# EAGLE design hdmi_receiver_backup (EAGLE 5.05)

## Sheet 1 of 2
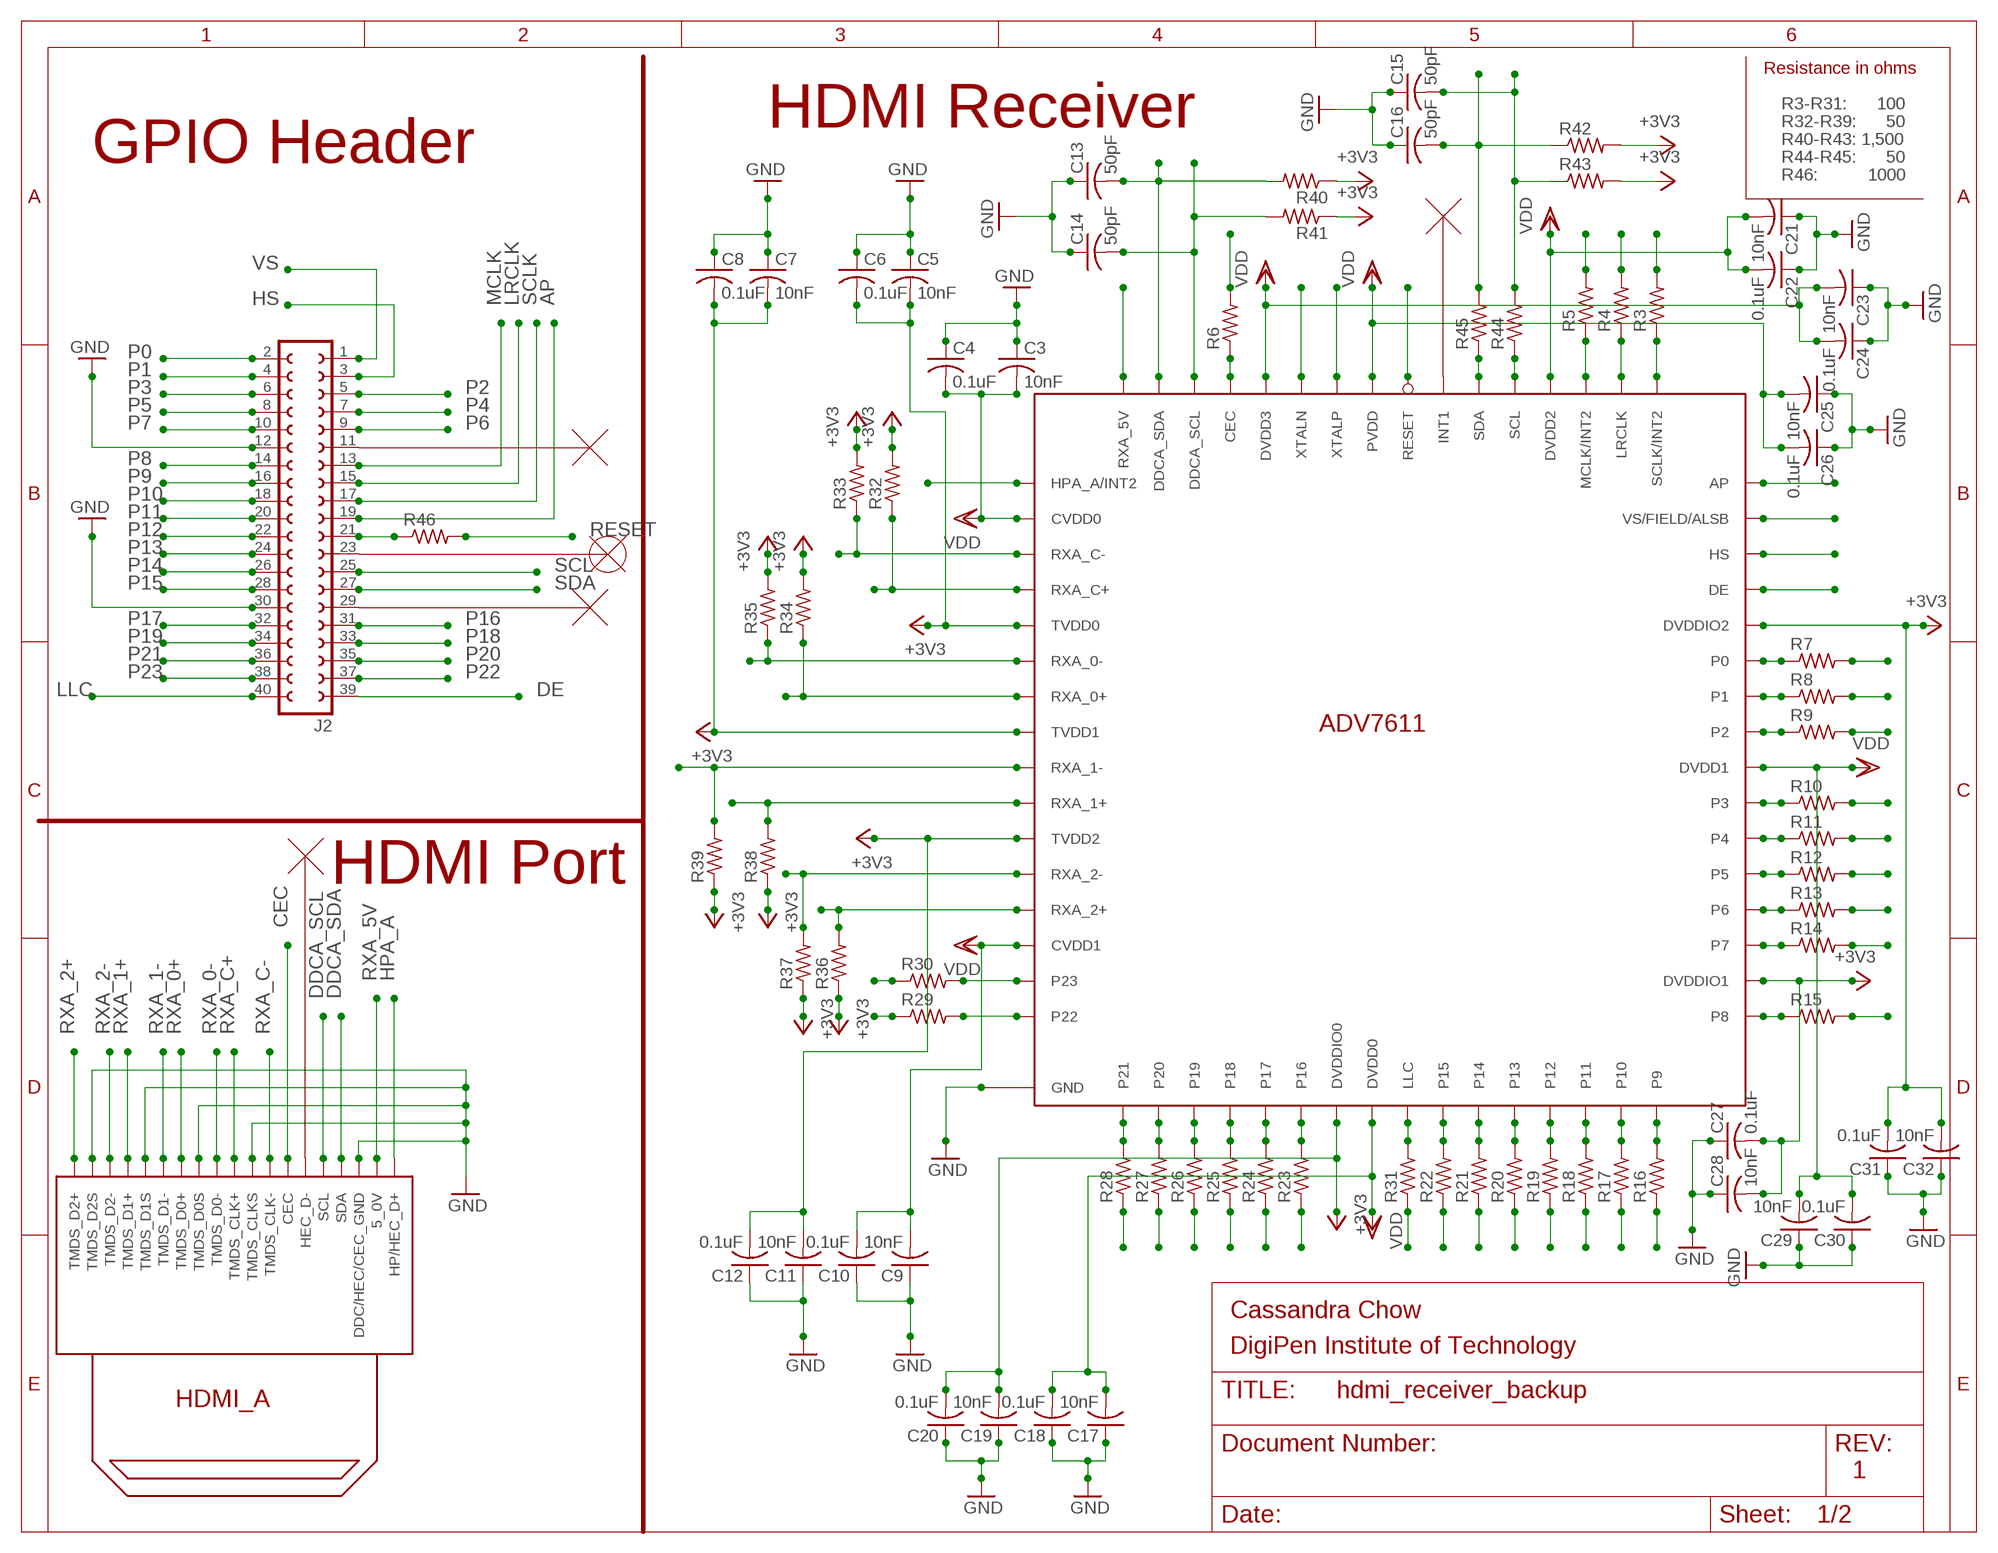
[diagram p0: schematic, sheet 1]

### Parts
ADV7611  ADV7611  [LQFP-ST-64-2]
C3  10nF  C-USC0603  [C0603]
C4  0.1uF  C-USC0603  [C0603]
C5  10nF  C-USC0603  [C0603]
C6  0.1uF  C-USC0603  [C0603]
C7  10nF  C-USC0603  [C0603]
C8  0.1uF  C-USC0603  [C0603]
C9  10nF  C-USC0603  [C0603]
C10  0.1uF  C-USC0603  [C0603]
C11  10nF  C-USC0603  [C0603]
C12  0.1uF  C-USC0603  [C0603]
C13  50pF  C-USC0603  [C0603]
C14  50pF  C-USC0603  [C0603]
C15  50pF  C-USC0603  [C0603]
C16  50pF  C-USC0603  [C0603]
C17  10nF  C-USC0603  [C0603]
C18  0.1uF  C-USC0603  [C0603]
C19  10nF  C-USC0603  [C0603]
C20  0.1uF  C-USC0603  [C0603]
C21  10nF  C-USC0603  [C0603]
C22  0.1uF  C-USC0603  [C0603]
C23  10nF  C-USC0603  [C0603]
C24  0.1uF  C-USC0603  [C0603]
C25  10nF  C-USC0603  [C0603]
C26  0.1uF  C-USC0603  [C0603]
C27  0.1uF  C-USC0603  [C0603]
C28  10nF  C-USC0603  [C0603]
C29  10nF  C-USC0603  [C0603]
C30  0.1uF  C-USC0603  [C0603]
C31  0.1uF  C-USC0603  [C0603]
C32  10nF  C-USC0603  [C0603]
J2  FE20-2  [FE20-2]
R3  R-US_R0603  [R0603]
R4  R-US_R0603  [R0603]
R5  R-US_R0603  [R0603]
R6  R-US_R0603  [R0603]
R7  R-US_R0603  [R0603]
R8  R-US_R0603  [R0603]
R9  R-US_R0603  [R0603]
R10  R-US_R0603  [R0603]
R11  R-US_R0603  [R0603]
R12  R-US_R0603  [R0603]
R13  R-US_R0603  [R0603]
R14  R-US_R0603  [R0603]
R15  R-US_R0603  [R0603]
R16  R-US_R0603  [R0603]
R17  R-US_R0603  [R0603]
R18  R-US_R0603  [R0603]
R19  R-US_R0603  [R0603]
R20  R-US_R0603  [R0603]
R21  R-US_R0603  [R0603]
R22  R-US_R0603  [R0603]
R23  R-US_R0603  [R0603]
R24  R-US_R0603  [R0603]
R25  R-US_R0603  [R0603]
R26  R-US_R0603  [R0603]
R27  R-US_R0603  [R0603]
R28  R-US_R0603  [R0603]
R29  R-US_R0603  [R0603]
R30  R-US_R0603  [R0603]
R31  R-US_R0603  [R0603]
R32  R-US_R0603  [R0603]
R33  R-US_R0603  [R0603]
R34  R-US_R0603  [R0603]
R35  R-US_R0603  [R0603]
R36  R-US_R0603  [R0603]
R37  R-US_R0603  [R0603]
R38  R-US_R0603  [R0603]
R39  R-US_R0603  [R0603]
R40  R-US_R0603  [R0603]
R41  R-US_R0603  [R0603]
R42  R-US_R0603  [R0603]
R43  R-US_R0603  [R0603]
R44  R-US_R0603  [R0603]
R45  R-US_R0603  [R0603]
R46  R-US_R0603  [R0603]
U$1  111RLF  [111RLF]

### Nets
+3V3: ADV7611.5(TVDD0) ADV7611.8(TVDD1) ADV7611.11(TVDD2) ADV7611.23(DVDDIO0) ADV7611.34(DVDDIO1) ADV7611.44(DVDDIO2) C5.2 C6.2 C7.2 C8.2 C11.2 C12.2 C19.2 C20.2 C27.2 C28.2 C31.2 C32.2 R32.2 R33.2 R34.2 R35.2 R36.1 R37.1 R38.1 R39.1 R40.1 R41.1 R42.2 R43.2 ; also sheet 2
AP: ADV7611.48(AP) J2.19
CEC: R6.2 U$1.13(CEC)
DDCA_SCL: ADV7611.62(DDCA_SCL) C14.2 R41.2 U$1.15(SCL)
DDCA_SDA: ADV7611.63(DDCA_SDA) C13.2 R40.2 U$1.16(SDA)
DE: ADV7611.45(DE) J2.39
GND: ADV7611.0(GND) C3.1 C4.1 C5.1 C6.1 C7.1 C8.1 C9.1 C10.1 C11.1 C12.1 C13.1 C14.1 C15.1 C16.1 C17.1 C18.1 C19.1 C20.1 C21.1 C22.1 C23.1 C24.1 C25.1 C26.1 C27.1 C28.1 C29.1 C30.1 C31.1 C32.1 J2.12 J2.30 U$1.2(TMDS_D2S) U$1.5(TMDS_D1S) U$1.8(TMDS_D0S) U$1.11(TMDS_CLKS) U$1.17(DDC/HEC/CEC_GND) ; also sheet 2
HPA_A: ADV7611.1(HPA_A/INT2) U$1.19(HP/HEC_D+)
HS: ADV7611.46(HS) J2.3
LLC: J2.40 R31.1
LRCLK: J2.15 R4.2
MCLK: J2.13 R5.2
N$1: ADV7611.25(LLC) R31.2
N$4: ADV7611.49(SCLK/INT2) R3.1
N$5: ADV7611.50(LRCLK) R4.1
N$6: ADV7611.51(MCLK/INT2) R5.1
N$7: ADV7611.61(CEC) R6.1
N$8: ADV7611.39(P3) R10.1
N$9: ADV7611.38(P4) R11.1
N$10: ADV7611.37(P5) R12.1
N$11: ADV7611.36(P6) R13.1
N$12: ADV7611.35(P7) R14.1
N$14: ADV7611.54(SDA) R45.1
N$15: ADV7611.53(SCL) R44.1
N$16: J2.21 R46.1
N$18: ADV7611.32(P9) R16.2
N$19: ADV7611.31(P10) R17.2
N$20: ADV7611.30(P11) R18.2
N$21: ADV7611.29(P12) R19.2
N$22: ADV7611.28(P13) R20.2
N$23: ADV7611.27(P14) R21.2
N$24: ADV7611.26(P15) R22.2
N$25: ADV7611.22(P16) R23.2
N$26: ADV7611.21(P17) R24.2
N$27: ADV7611.20(P18) R25.2
N$28: ADV7611.19 R26.2
N$29: ADV7611.18(P20) R27.2
N$30: ADV7611.17(P21) R28.2
N$44: ADV7611.16(P22) R29.2
N$45: ADV7611.15(P23) R30.2
N$48: ADV7611.33(P8) R15.1
N$49: ADV7611.41(P2) R9.1
N$51: ADV7611.42(P1) R8.1
N$52: ADV7611.43(P0) R7.1
P0: J2.2 R7.2
P1: J2.4 R8.2
P2: J2.5 R9.2
P3: J2.6 R10.2
P4: J2.7 R11.2
P5: J2.8 R12.2
P6: J2.9 R13.2
P7: J2.10 R14.2
P8: J2.14 R15.2
P9: J2.16 R16.1
P10: J2.18 R17.1
P11: J2.20 R18.1
P12: J2.22 R19.1
P13: J2.24 R20.1
P14: J2.26 R21.1
P15: J2.28 R22.1
P16: J2.31 R23.1
P17: J2.32 R24.1
P18: J2.33 R25.1
P19: J2.34 R26.1
P20: J2.35 R27.1
P21: J2.36 R28.1
P22: J2.37 R29.1
P23: J2.38 R30.1
RESET: ADV7611.56(RESET) R46.2 ; also sheet 2
RXA_0+: ADV7611.7(RXA_0+) R34.1 U$1.7(TMDS_D0+)
RXA_0-: ADV7611.6(RXA_0-) R35.1 U$1.9(TMDS_D0-)
RXA_1+: ADV7611.10(RXA_1+) R38.2 U$1.4(TMDS_D1+)
RXA_1-: ADV7611.9(RXA_1-) R39.2 U$1.6(TMDS_D1-)
RXA_2+: ADV7611.13(RXA_2+) R36.2 U$1.1(TMDS_D2+)
RXA_2-: ADV7611.12(RXA_2-) R37.2 U$1.3(TMDS_D2-)
RXA_5V: ADV7611.64(RXA_5V) U$1.18(5_0V)
RXA_C+: ADV7611.4(RXA_C+) R32.1 U$1.10(TMDS_CLK+)
RXA_C-: ADV7611.3(RXA_C-) R33.1 U$1.12(TMDS_CLK-)
SCL: C15.2 J2.25 R43.1 R44.2
SCLK: J2.17 R3.2
SDA: C16.2 J2.27 R42.1 R45.2
VDD: ADV7611.2(CVDD0) ADV7611.14(CVDD1) ADV7611.24(DVDD0) ADV7611.40(DVDD1) ADV7611.52(DVDD2) ADV7611.57(PVDD) ADV7611.60(DVDD3) C3.2 C4.2 C9.2 C10.2 C17.2 C18.2 C21.2 C22.2 C23.2 C24.2 C25.2 C26.2 C29.2 C30.2 ; also sheet 2
VS: ADV7611.47(VS/FIELD/ALSB) J2.1
XTALN: ADV7611.59(XTALN) ; also sheet 2
XTALP: ADV7611.58(XTALP) ; also sheet 2
Unconnected: ADV7611.55(INT1) J2.11 J2.23 J2.29 U$1.14(HEC_D-)

### Notes on the sheet
- Resistance in ohms
- R3-R31:      100
- HDMI Receiver | R32-R39:      50
- R40-R43: 1,500
- GPIO Header | R44-R45:      50
- R46:          1000
- VS
- HS | MCLK | LRCLK | SCLK | AP
- P0
- P1
- P3 | P2
- P5 | P4
- P7 | P6
- P8
- P9
- P10
- P11
- P12 | RESET
- P13
- P14 | SCL
- P15 | SDA
- P17 | P16
- P19 | P18
- P21 | P20
- P23 | P22
- LLC | DE
- HDMI Port
- CEC
- RXA_5V | HPA_A
- DDCA_SCL | DDCA_SDA
- RXA_2+ | RXA_2- | RXA_1+ | RXA_1- | RXA_0+ | RXA_0- | RXA_C+ | RXA_C-
- Cassandra Chow
- DigiPen Institute of Technology
- 1

## Sheet 2 of 2
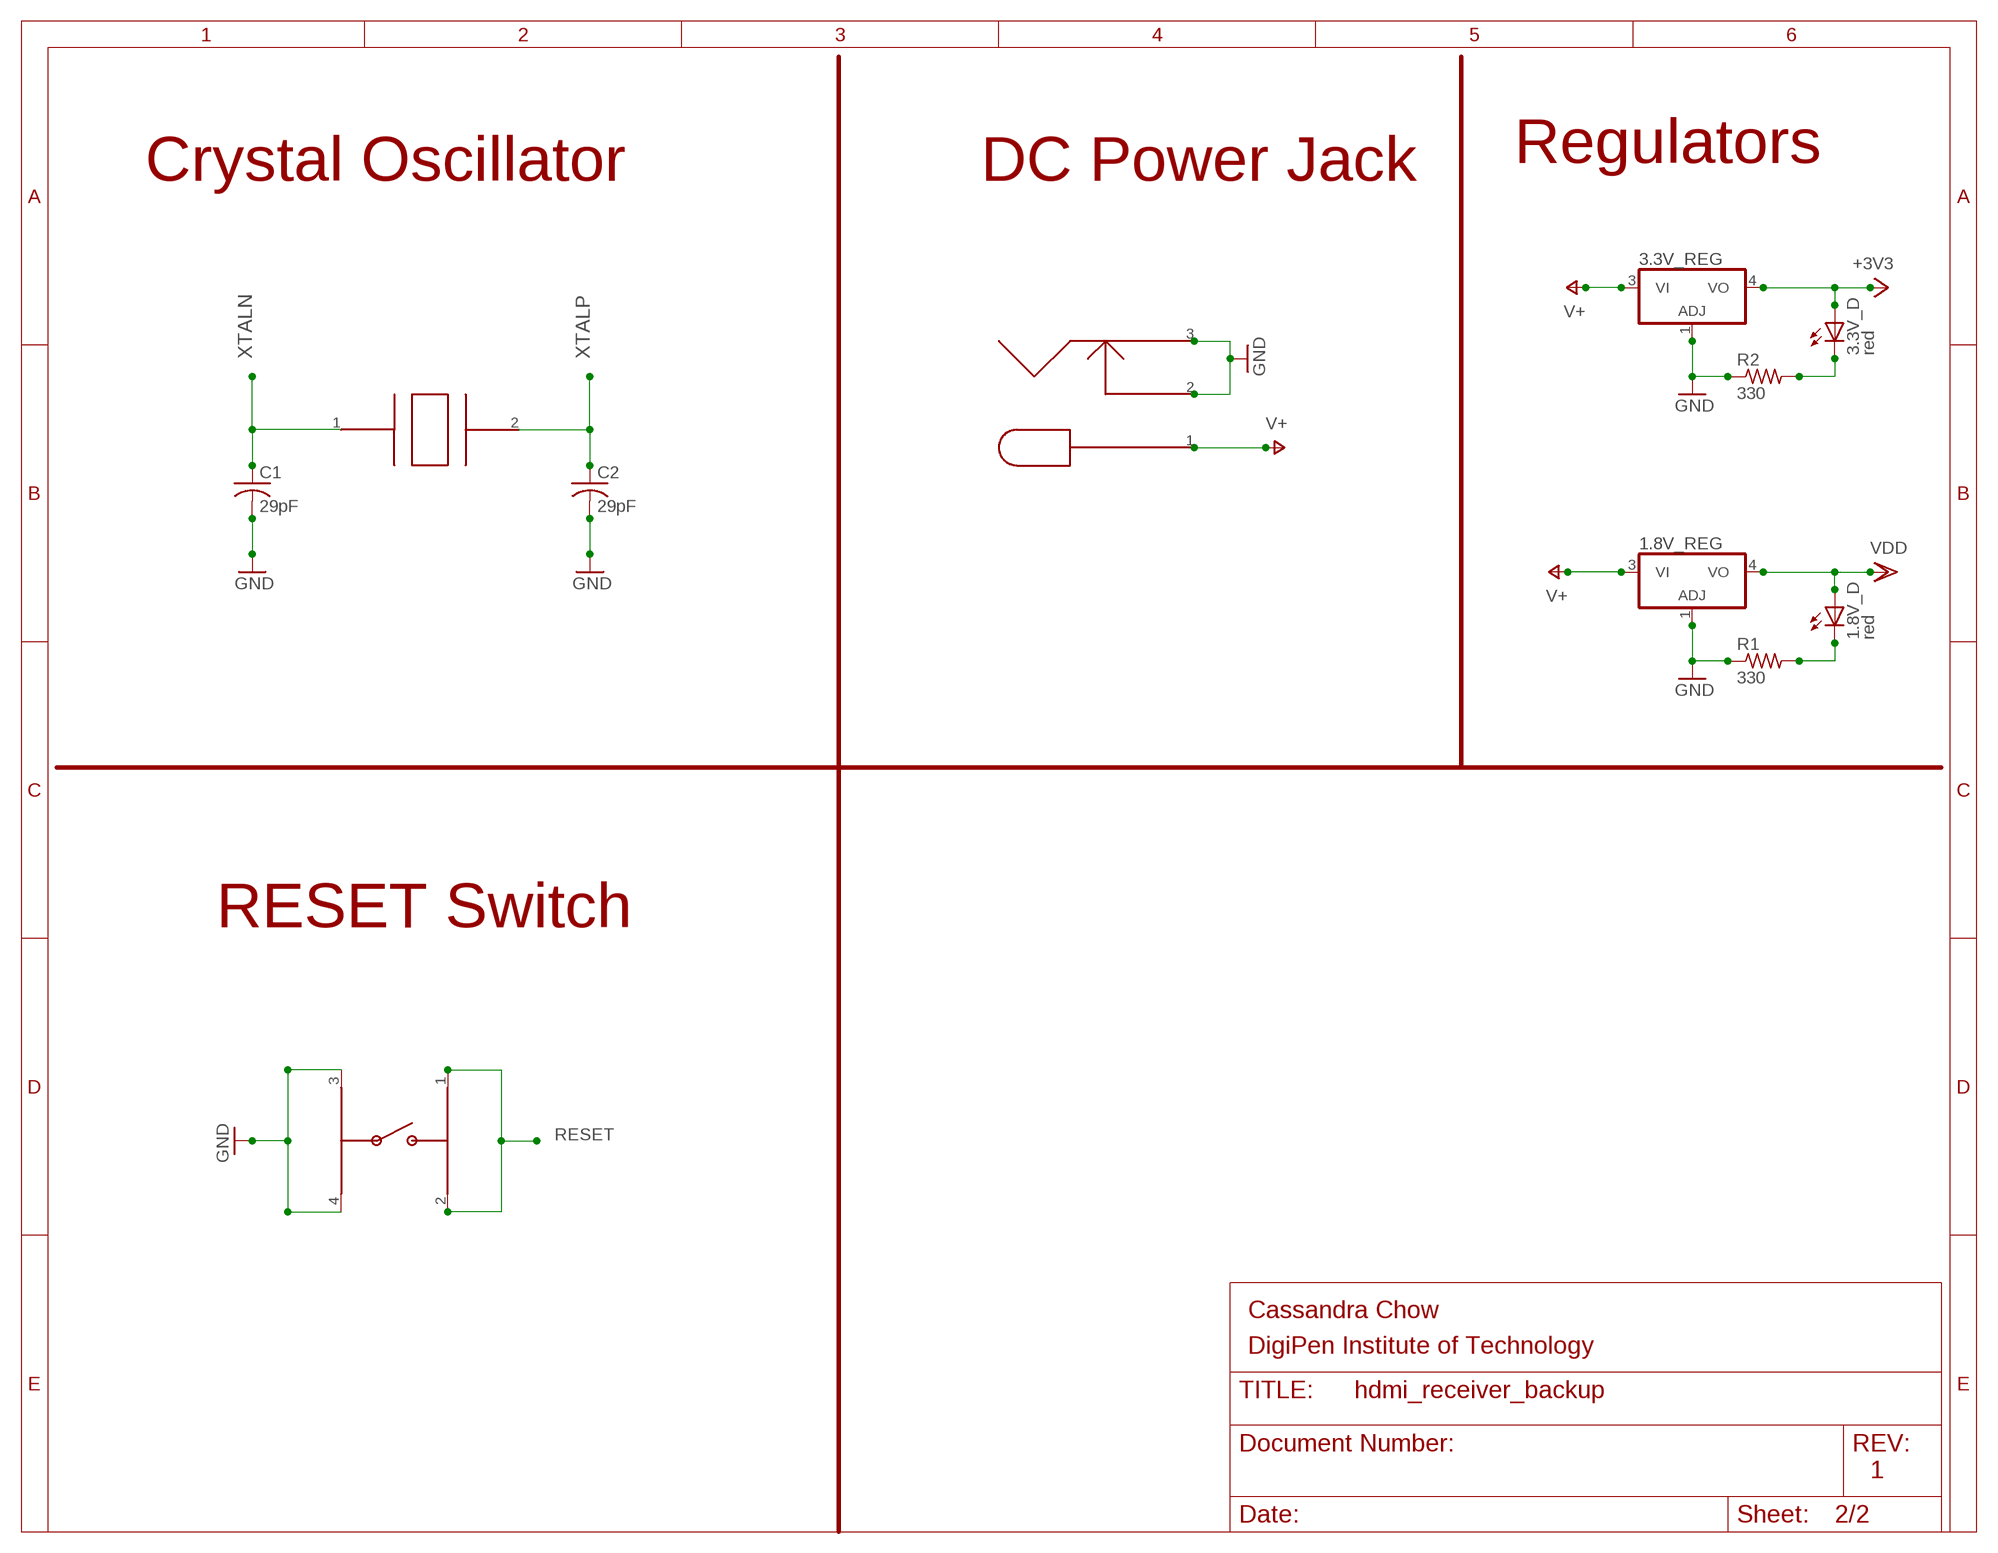
[diagram p1: schematic, sheet 2]

### Parts
1.8V_D  red  LED5MM  [LED5MM]
1.8V_REG  317EMP  [SOT223]
3.3V_D  red  LED5MM  [LED5MM]
3.3V_REG  317EMP  [SOT223]
C1  29pF  C-USC1210  [C1210]
C2  29pF  C-USC1210  [C1210]
R1  330  R-US_R0603  [R0603]
R2  330  R-US_R0603  [R0603]
U$2  CRYSTAL_OSC  [CRYSTAL_OSC]
U$3  CK_SWITCH  [CK_SWITCH]
U$4  DC_BARREL_CONN  [DC_BARREL_CONN]

### Nets
+3V3: 3.3V_D.A 3.3V_REG.4(VO) ; also sheet 1
GND: 1.8V_REG.1(ADJ) 3.3V_REG.1(ADJ) C1.2 C2.2 R1.1 R2.1 U$3.3 U$3.4 U$4.2 U$4.3 ; also sheet 1
N$2: 1.8V_D.K(C) R1.2
N$3: 3.3V_D.K(C) R2.2
RESET: U$3.1 U$3.2 ; also sheet 1
V+: 1.8V_REG.3(VI) 3.3V_REG.3(VI) U$4.1
VDD: 1.8V_D.A 1.8V_REG.4(VO) ; also sheet 1
XTALN: C1.1 U$2.1 ; also sheet 1
XTALP: C2.1 U$2.2 ; also sheet 1

### Notes on the sheet
- Crystal Oscillator | DC Power Jack | Regulators
- XTALN | XTALP
- RESET Switch
- RESET
- Cassandra Chow
- DigiPen Institute of Technology
- 1

## Library data of the parts
1.8V_D 3.3V_D = led:LED: LED OSRAM: - CHIPLED LG R971, LG N971, LY N971, LG Q971, LY Q971, LO R971, LY R971 LH N974, LH R974 LS Q976, LO Q976, LY Q976 LO Q996 - Hyper CHIPLED LW Q18S LB Q993, LB Q99A, LB R99A - SideLED LS A670, LO A670, LY A670, LG A670, LP A670 LB A673, LV A673, LT A673, LW A673 LH A674 LY A675 LS A676, LA A676, LO A676, LY A676, LW A676 LS A679, LY A679, LG A679 - Hyper Micro SIDELED® LS Y876, LA Y876, LO Y876, LY Y876 LT Y87S - SmartLED LW L88C, LW L88S LB L89C, LB L89S, LG L890 LS L89K, LO L89K, LY L89K LS L896, LA L896, LO L896, LY L896 - TOPLED LS T670, LO T670, LY T670, LG T670, LP T670 LSG T670, LSP T670, LSY T670, LOP T670, LYG T670 LG T671, LOG T671, LSG T671 LB T673, LV T673, LT T673, LW T673 LH T674 LS T676, LA T676, LO T676, LY T676, LB T676, LH T676, LSB T676, LW T676 LB T67C, LV T67C, LT T67C, LS T67K, LO T67K, LY T67K, LW E67C LS E67B, LA E67B, LO E67B, LY E67B, LB E67C, LV E67C, LT E67C LW T67C LS T679, LY T679, LG T679 LS T770, LO T770, LY T770, LG T770, LP T770 LB T773, LV T773, LT T773, LW T773 LH T774 LS E675, LA E675, LY E675, LS T675 LS T776, LA T776, LO T776, LY T776, LB T776 LHGB T686 LT T68C, LB T68C - Hyper Mini TOPLED® LB M676 - Mini TOPLED Santana® LG M470 LS M47K, LO M47K, LY M47K Source: http://www.osram.convergy.de LUXEON: - LUMILED® LXK2-PW12-R00, LXK2-PW12-S00, LXK2-PW14-U00, LXK2-PW14-V00 LXK2-PM12-R00, LXK2-PM12-S00, LXK2-PM14-U00 LXK2-PE12-Q00, LXK2-PE12-R00, LXK2-PE12-S00, LXK2-PE14-T00, LXK2-PE14-U00 LXK2-PB12-K00, LXK2-PB12-L00, LXK2-PB12-M00, LXK2-PB14-N00, LXK2-PB14-P00, LXK2-PB14-Q00 LXK2-PR12-L00, LXK2-PR12-M00, LXK2-PR14-Q00, LXK2-PR14-R00 LXK2-PD12-Q00, LXK2-PD12-R00, LXK2-PD12-S00 LXK2-PH12-R00, LXK2-PH12-S00 LXK2-PL12-P00, LXK2-PL12-Q00, LXK2-PL12-R00 Source: www.luxeon.com KINGBRIGHT: KA-3528ASYC Source: www.kingbright.com
1.8V_REG 3.3V_REG = linear:*317: Positive VOLTAGE REGULATOR
ADV7611 = cchow_2014:ADV7611
C1-C32 = rcl:C-US: CAPACITOR, American symbol
J2 = con-lsta:FE20-2: FEMALE HEADER
R1-R46 = resistor:R-US_: RESISTOR, American symbol
U$1 = cchow_2014:111RLF
U$2 = cchow_2014:CRYSTAL_OSC
U$3 = cchow_2014:CK_SWITCH
U$4 = cchow_2014:DC_BARREL_CONN

## Board
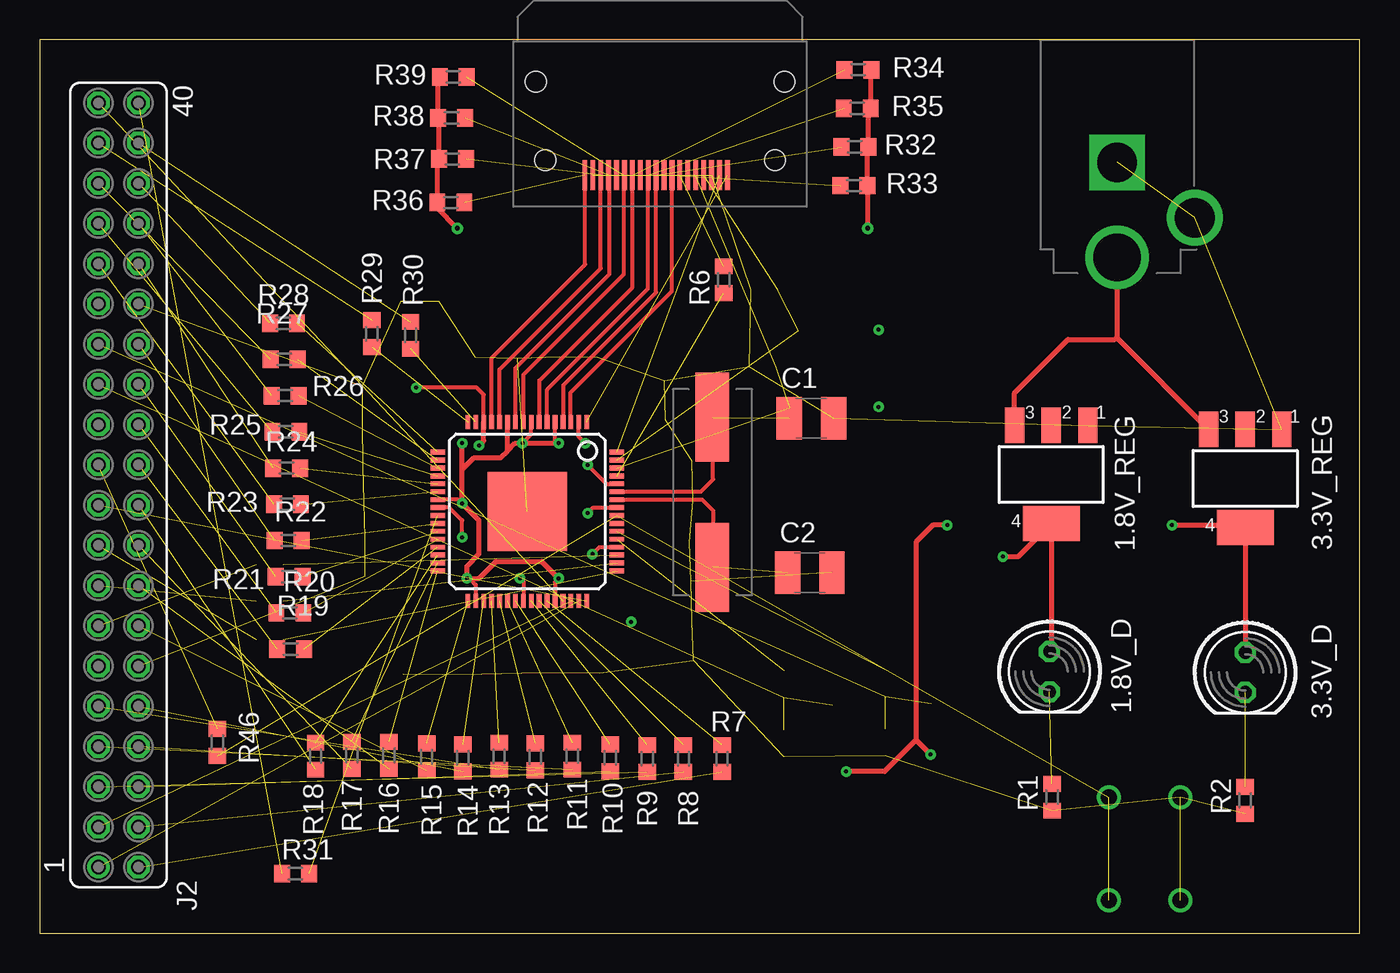
[diagram p2: board, top side]
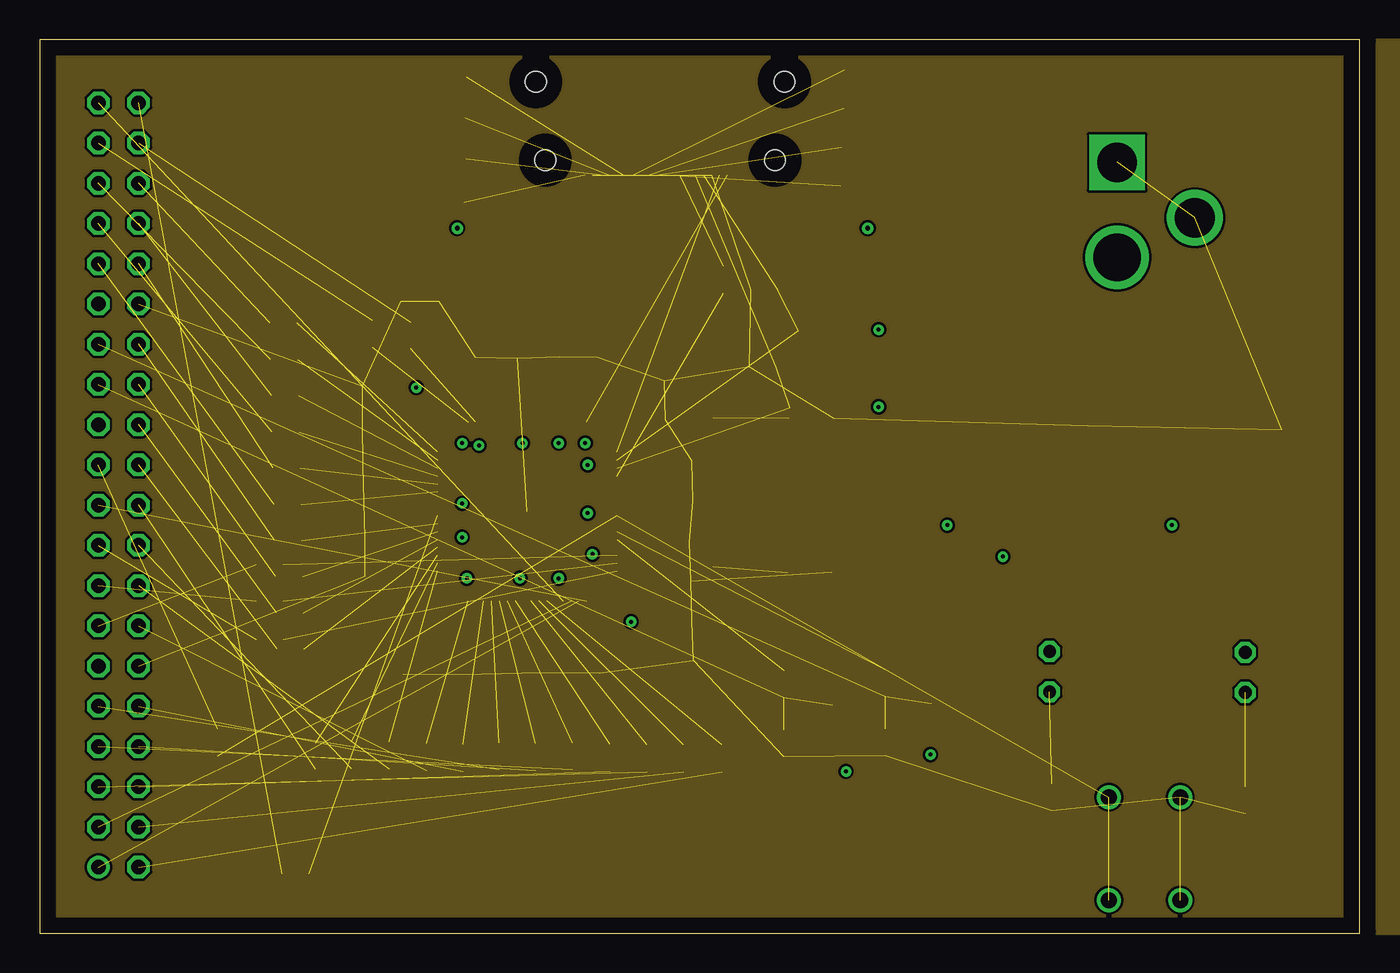
[diagram p3: board, inner layer Route2]
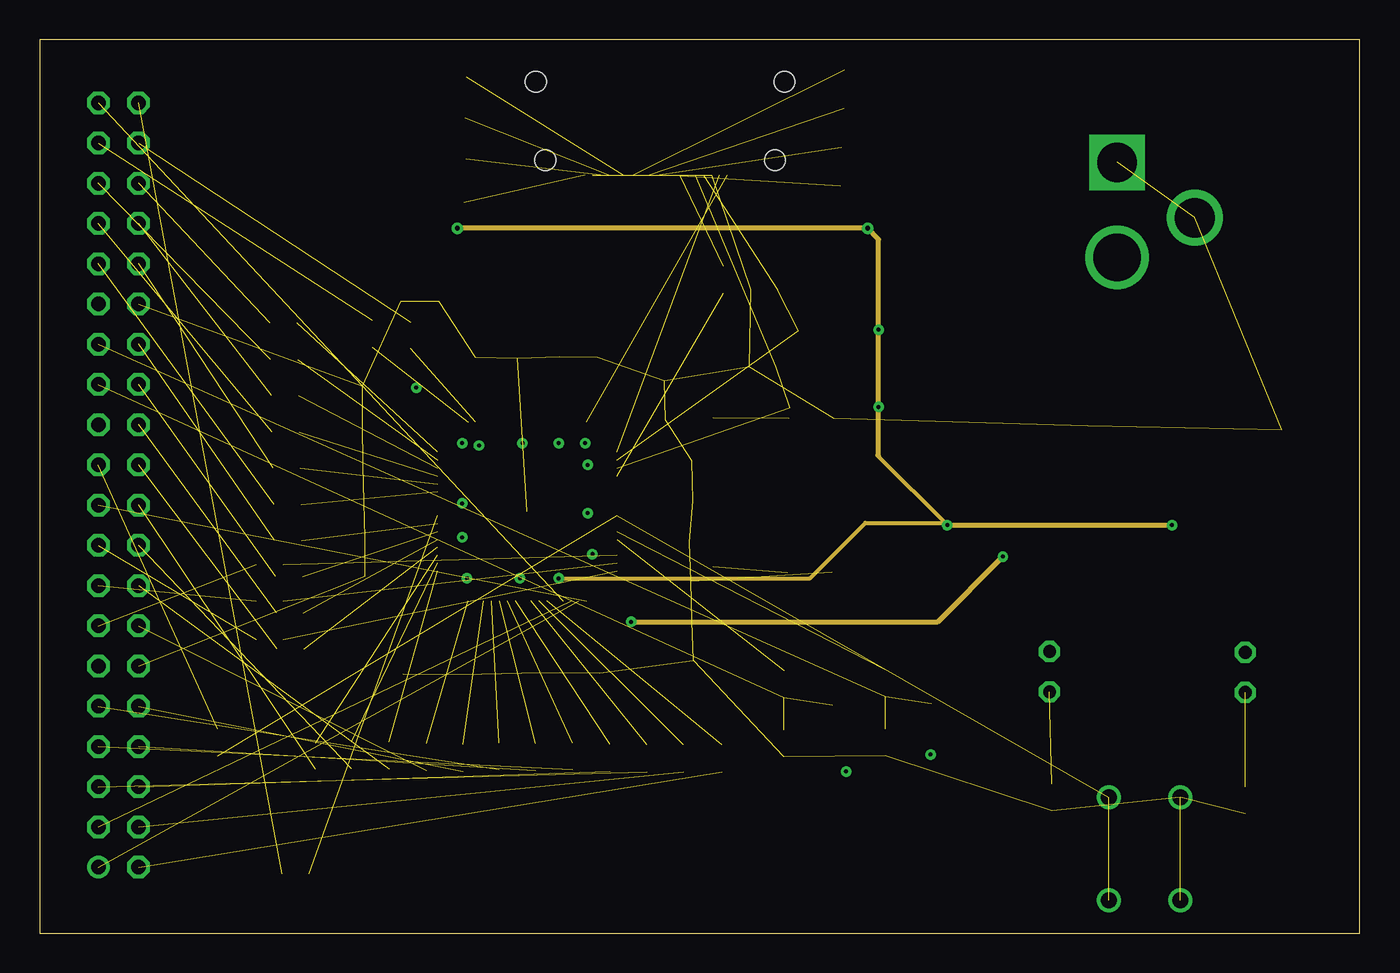
[diagram p4: board, inner layer Route3]
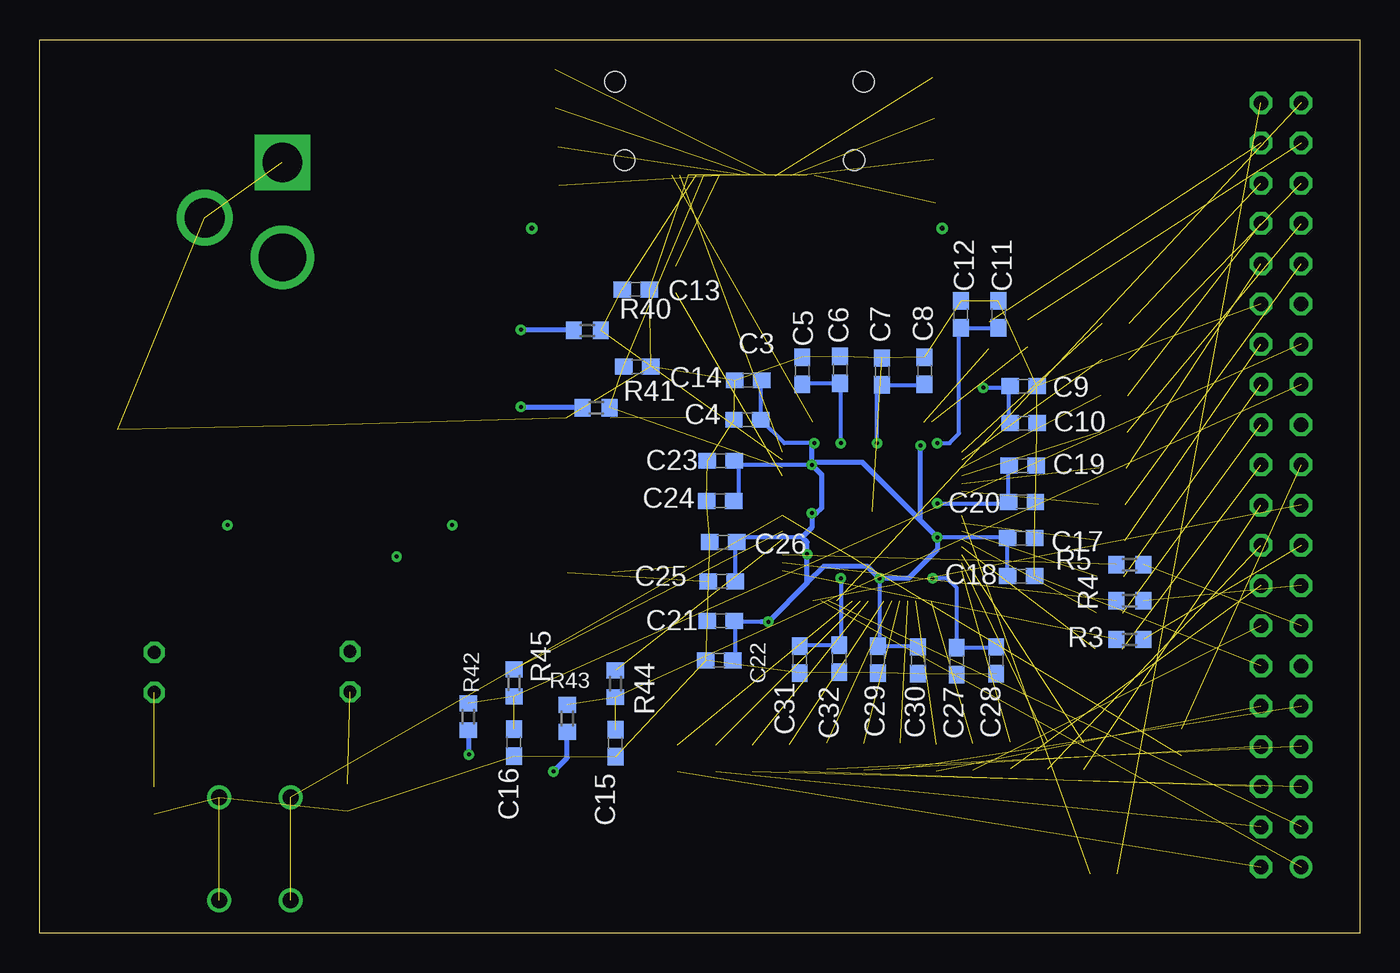
[diagram p5: board, bottom side, seen from below]

Size 83.34 x 56.41 mm. Coordinates in mm from the lower left corner, seen from the top.
Outline: 0,0 83.34,0 83.34,56.41 0,56.41 0,0
Copper layers (1*2*3*16): Top 0.035mm / dielectric 0.2286mm / Route2 0.07mm / dielectric 0.9906mm / Route3 0.07mm / dielectric 0.2286mm / Bottom 0.035mm
Design rules "default *": minimum track width 10mil, minimum drill 10mil, track to track 6mil, track to pad 6mil, pad to pad 6mil, via to via 6mil, smd to smd 6mil, copper to edge 40mil, drill to drill 10mil, minimum pad ring 10mil, minimum via ring 8mil, stop-mask expansion 4mil, vias tented up to drill 0mil, thermal gap 10mil
vRestrict: area 39.6,20.1 to 45.4,35.7

### Footprints (pad centres in the part's own frame; a part is rotated, then mirrored left to right if it is on the bottom)
LED5MM = drill 0.813 octagon: A -1.27,0; K 1.27,0
SOT223 = smd 1.219 x 2.235: 1 -2.311,-3.099; 2 0,-3.099; 3 2.311,-3.099 | smd 3.6 x 2.2: 4 0,3.099
LQFP-ST-64-2 = smd 5 x 5: 0 0,0 | smd 0.9 x 0.3: 1 -5.65,3.75; 2 -5.65,3.25; 3 -5.65,2.75; 4 -5.65,2.25; 5 -5.65,1.75; 6 -5.65,1.25; 7 -5.65,0.75; 8 -5.65,0.25; 9 -5.65,-0.25; 10 -5.65,-0.75; 11 -5.65,-1.25; 12 -5.65,-1.75; 13 -5.65,-2.25; 14 -5.65,-2.75; 15 -5.65,-3.25; 16 -5.65,-3.75; 33 5.65,-3.75; 34 5.65,-3.25; 35 5.65,-2.75; 36 5.65,-2.25; 37 5.65,-1.75; 38 5.65,-1.25; 39 5.65,-0.75; 40 5.65,-0.25; 41 5.65,0.25; 42 5.65,0.75; 43 5.65,1.25; 44 5.65,1.75; 45 5.65,2.25; 46 5.65,2.75; 47 5.65,3.25; 48 5.65,3.75 | smd 0.3 x 0.9: 17 -3.75,-5.65; 18 -3.25,-5.65; 19 -2.75,-5.65; 20 -2.25,-5.65; 21 -1.75,-5.65; 22 -1.25,-5.65; 23 -0.75,-5.65; 24 -0.25,-5.65; 25 0.25,-5.65; 26 0.75,-5.65; 27 1.25,-5.65; 28 1.75,-5.65; 29 2.25,-5.65; 30 2.75,-5.65; 31 3.25,-5.65; 32 3.75,-5.65; 49 3.75,5.65; 50 3.25,5.65; 51 2.75,5.65; 52 2.25,5.65; 53 1.75,5.65; 54 1.25,5.65; 55 0.75,5.65; 56 0.25,5.65; 57 -0.25,5.65; 58 -0.75,5.65; 59 -1.25,5.65; 60 -1.75,5.65; 61 -2.25,5.65; 62 -2.75,5.65; 63 -3.25,5.65; 64 -3.75,5.65
C1210 = smd 1.6 x 2.7: 1 -1.4,0; 2 1.4,0
C0603 = smd 1.1 x 1: 1 -0.85,0; 2 0.85,0
FE20-2 = drill 0.914 round: 1 -24.13,1.27 | drill 0.914 octagon: 2 -24.13,-1.27; 3 -21.59,1.27; 4 -21.59,-1.27; 5 -19.05,1.27; 6 -19.05,-1.27; 7 -16.51,1.27; 8 -16.51,-1.27; 9 -13.97,1.27; 10 -13.97,-1.27; 11 -11.43,1.27; 12 -11.43,-1.27; 13 -8.89,1.27; 14 -8.89,-1.27; 15 -6.35,1.27; 16 -6.35,-1.27; 17 -3.81,1.27; 18 -3.81,-1.27; 19 -1.27,1.27; 20 -1.27,-1.27; 21 1.27,1.27; 22 1.27,-1.27; 23 3.81,1.27; 24 3.81,-1.27; 25 6.35,1.27; 26 6.35,-1.27; 27 8.89,1.27; 28 8.89,-1.27; 29 11.43,1.27; 30 11.43,-1.27; 31 13.97,1.27; 32 13.97,-1.27; 33 16.51,1.27; 34 16.51,-1.27; 35 19.05,1.27; 36 19.05,-1.27; 37 21.59,1.27; 38 21.59,-1.27; 39 24.13,1.27; 40 24.13,-1.27
R0603 = smd 1 x 1.1: 1 -0.85,0; 2 0.85,0
111RLF = smd 0.3 x 1.9: 1 4.75,0; 2 4.25,0; 3 3.75,0; 4 3.25,0; 5 2.75,0; 6 2.25,0; 7 1.75,0; 8 1.25,0; 9 0.75,0; 10 0.25,0; 11 -0.25,0; 12 -0.75,0; 13 -1.25,0; 14 -1.75,0; 15 -2.25,0; 16 -2.75,0; 17 -3.25,0; 18 -3.75,0; 19 -4.25,0 | hole 1.3: -7.25,-0.95; 7.25,-0.95; -7.85,-5.9; 7.85,-5.9
CRYSTAL_OSC = smd 5.6 x 2.1: 1 -4.75,0; 2 4.75,0
CK_SWITCH = drill 1 round: 1 -3.25,2.25; 2 3.25,2.25; 3 -3.25,-2.25; 4 3.25,-2.25
DC_BARREL_CONN = drill 3 round: 1 6,0 | drill 2.5 round: 2 3.5,4.9 | drill 2.5 square: 3 0,0

### Placement (x,y rotation side)
1.8V_D  63.75,16.51 270 top
1.8V_REG  63.86,28.96 180 top
3.3V_D  76.1,16.46 270 top
3.3V_REG  76.1,28.7 180 top
ADV7611  30.78,26.62 270 top
C1  48.72,32.51 0 top
C2  48.62,22.76 0 top
C3  38.61,34.9 0 bottom
C4  38.66,32.41 0 bottom
C5  35.2,35.51 270 bottom
C6  32.82,35.56 270 bottom
C7  30.18,35.46 270 bottom
C8  27.48,35.51 270 bottom
C9  21.23,34.54 180 bottom
C10  21.23,32.21 180 bottom
C11  22.81,39.07 270 bottom
C12  25.2,39.07 270 bottom
C13  45.72,40.64 180 bottom
C14  45.62,35.76 180 bottom
C15  46.99,11.99 90 bottom
C16  53.39,12.04 90 bottom
C17  21.39,24.94 180 bottom
C18  21.39,22.56 180 bottom
C19  21.29,29.51 180 bottom
C20  21.34,27.23 180 bottom
C21  40.34,19.71 0 bottom
C22  40.44,17.22 0 bottom
C23  40.34,29.82 0 bottom
C24  40.39,27.28 0 bottom
C25  40.28,22.2 0 bottom
C26  40.18,24.69 0 bottom
C27  25.45,17.17 90 bottom
C28  22.96,17.22 90 bottom
C29  30.43,17.27 90 bottom
C30  27.89,17.22 90 bottom
C31  35.36,17.27 90 bottom
C32  32.87,17.32 90 bottom
J2  4.98,28.3 90 top
R1  63.91,8.59 90 top
R2  76.1,8.38 90 top
R3  14.53,18.54 0 bottom
R4  14.53,20.98 0 bottom
R5  14.53,23.27 0 bottom
R6  43.18,41.25 90 top
R7  43.08,11.02 270 top
R8  40.64,11.02 270 top
R9  38.35,11.02 270 top
R10  36.02,11.07 270 top
R11  33.63,11.18 270 top
R12  31.29,11.13 270 top
R13  29.01,11.18 270 top
R14  26.72,11.07 270 top
R15  24.43,11.13 270 top
R16  22.05,11.23 90 top
R17  19.71,11.23 90 top
R18  17.42,11.18 90 top
R19  15.85,17.93 0 top
R20  15.8,20.22 0 top
R21  15.75,22.5 0 top
R22  15.7,24.79 0 top
R23  15.65,27.08 0 top
R24  15.6,29.36 0 top
R25  15.54,31.65 0 top
R26  15.49,33.93 0 top
R27  15.44,36.22 0 top
R28  15.39,38.51 0 top
R29  20.98,37.85 270 top
R30  23.42,37.74 270 top
R31  16.15,3.76 0 top
R32  51.46,49.63 0 top
R33  51.41,47.19 0 top
R34  51.66,54.51 0 top
R35  51.61,52.07 0 top
R36  25.96,46.13 0 top
R37  26.06,48.87 0 top
R38  26.01,51.46 0 top
R39  26.11,54.05 0 top
R40  48.77,38.05 0 bottom
R41  48.21,33.17 0 bottom
R42  56.29,13.67 270 bottom
R43  50.04,13.56 270 bottom
R44  46.99,15.75 270 bottom
R45  53.39,15.8 270 bottom
R46  11.23,12.04 270 top
U$1  39.17,47.85 180 top
U$2  42.47,27.84 270 top
U$3  69.75,5.33 90 top
U$4  68.02,48.67 270 top

### Tracks (layer width: path | path; a pad name or v marks a point on that pad's centre or on a via)
+3V3  (via drill 0.25, 0.3)
  Top 0.254: ADV7611.5 32.53,31.17 v32.77,30.94 | ADV7611.8 31.04,31.49 v30.48,30.94 | v26.98,22.4 27.13,22.4 27.54,22 ADV7611.34 | v52.27,44.5 52.26,44.51 | ADV7611.44 32.53,22.17 v32.77,22.4 | ADV7611.23 26.43,27.37 v26.67,27.13
  Top 0.305: 3.3V_D.A 3.3V_REG.4 75.95,25.76 v71.48,25.76 | 27.13,22.4 27.74,22.4 28.8,23.47 31.7,23.47 v32.77,22.4 | v26.98,22.4 26.98,23.16 27.74,23.93 27.74,26.06 v26.67,27.13 26.67,29.26 | v32.77,30.94 v30.48,30.94 30.02,30.94 29.54,30.45 | v52.27,44.5 52.27,47.18 R33.2 52.26,49.58 R32.2 52.31,51.92 R35.2 52.46,54.46 R34.2 | v26.36,44.5 25.11,45.76 R36.1 25.11,48.77 R37.1 25.21,51.41 R38.1 25.16,53.95 R39.1 | v57.3,25.76 56.39,25.76 55.32,24.69 55.32,12.19 | 55.32,12.19 v56.24,11.28 | v50.9,10.21 53.34,10.21 55.32,12.19 | 26.67,29.26 v26.67,30.94 | 26.67,29.26 27.43,30.02 29.11,30.02 29.54,30.45 | 29.54,30.45 ADV7611.11
  Route3 0.254: 52.88,30.18 52.96,30.1 v57.3,25.76 57.15,25.91 52.12,25.91 48.62,22.4 v32.77,22.4
  Route3 0.305: v57.3,25.76 v71.48,25.76 | 52.96,30.1 v52.96,33.22 v52.96,38.1 52.96,43.81 v52.27,44.5 v26.36,44.5
  Bottom 0.254: C5.2 35.15,34.71 C6.2 32.77,34.66 v32.77,30.94 | v30.48,30.94 30.48,34.3 C7.2 27.53,34.61 C8.2 | C11.2 C12.2 25.3,38.11 25.3,31.55 25.91,30.94 v26.67,30.94 | v26.67,27.13 22.29,27.13 C20.2 22.19,29.46 C19.2 | v26.98,22.4 26.06,22.4 25.45,21.79 C27.2 23.01,18.02 C28.2 | C31.2 35.31,18.17 C32.2 32.77,18.27 v32.77,22.4
  Bottom 0.305: v56.24,11.28 56.24,12.76 R42.2 | R43.2 50.04,11.07 v50.9,10.21 | R40.1 49.67,38.1 v52.96,38.1 | R41.1 49.11,33.22 v52.96,33.22
AP  (1 unrouted)
CEC  (1 unrouted)
DDCA_SCL  (3 unrouted)
DDCA_SDA  (3 unrouted)
DE  (1 unrouted)
GND  (47 unrouted)
HPA_A  (1 unrouted)
HS  (1 unrouted)
LLC  (1 unrouted)
LRCLK  (1 unrouted)
MCLK  (1 unrouted)
N$1  (1 unrouted)
N$2  (1 unrouted)
N$3  (1 unrouted)
N$4  (1 unrouted)
N$5  (1 unrouted)
N$6  (1 unrouted)
N$7  (1 unrouted)
N$8  (1 unrouted)
N$9  (1 unrouted)
N$10  (1 unrouted)
N$11  (1 unrouted)
N$12  (1 unrouted)
N$13
  pour Route2: 0,56.39 87.17,56.39 87.17,0 0,0
N$14  (1 unrouted)
N$15  (1 unrouted)
N$16  (1 unrouted)
N$18  (1 unrouted)
N$19  (1 unrouted)
N$20  (1 unrouted)
N$21  (1 unrouted)
N$22  (1 unrouted)
N$23  (1 unrouted)
N$24  (1 unrouted)
N$25  (1 unrouted)
N$26  (1 unrouted)
N$27  (1 unrouted)
N$28  (1 unrouted)
N$29  (1 unrouted)
N$30  (1 unrouted)
N$44  (1 unrouted)
N$45  (1 unrouted)
N$48  (1 unrouted)
N$49  (1 unrouted)
N$51  (1 unrouted)
N$52  (1 unrouted)
P0  (1 unrouted)
P1  (1 unrouted)
P2  (1 unrouted)
P3  (1 unrouted)
P4  (1 unrouted)
P5  (1 unrouted)
P6  (1 unrouted)
P7  (1 unrouted)
P8  (1 unrouted)
P9  (1 unrouted)
P10  (1 unrouted)
P11  (1 unrouted)
P12  (1 unrouted)
P13  (1 unrouted)
P14  (1 unrouted)
P15  (1 unrouted)
P16  (1 unrouted)
P17  (1 unrouted)
P18  (1 unrouted)
P19  (1 unrouted)
P20  (1 unrouted)
P21  (1 unrouted)
P22  (1 unrouted)
P23  (1 unrouted)
RESET  (3 unrouted)
RXA_0+  (1 unrouted)
  Top 0.254: U$1.7 37.42,40.77 31.55,34.9 31.55,32.28 ADV7611.7
RXA_0-  (1 unrouted)
  Top 0.254: ADV7611.6 32.03,34.32 38.41,40.69 38.41,47.84 U$1.9
RXA_1+  (1 unrouted)
  Top 0.254: ADV7611.10 30.04,35.67 35.97,41.6 35.97,47.8 U$1.4
RXA_1-  (1 unrouted)
  Top 0.254: ADV7611.9 30.54,35.26 36.88,41.6 36.88,47.82 U$1.6
RXA_2+  (1 unrouted)
  Top 0.254: ADV7611.13 28.54,36.31 34.44,42.22 34.44,47.83 U$1.1
RXA_2-  (1 unrouted)
  Top 0.254: ADV7611.12 29.04,35.59 35.42,41.97 U$1.3
RXA_5V  (1 unrouted)
RXA_C+  (1 unrouted)
  Top 0.254: U$1.10 38.92,40.44 33.07,34.59 33.07,32.3 ADV7611.4
RXA_C-  (1 unrouted)
  Top 0.254: U$1.12 39.92,40.53 33.53,34.14 ADV7611.3
SCL  (3 unrouted)
SCLK  (1 unrouted)
SDA  (3 unrouted)
V+
  Top 0.305: 68.02,37.64 68.02,37.57 3.3V_REG.3 | 68.02,37.64 U$4.1 | 1.8V_REG.3 61.54,34.11 64.92,37.49 67.87,37.49 68.02,37.64
VDD  (via drill 0.25)
  Top 0.254: ADV7611.2 34.03,31.34 v34.44,30.94 | ADV7611.14 28.04,33.99 27.58,34.44 v23.77,34.44 | ADV7611.24 25.86,26.87 26.67,26.06 v26.67,24.99 | ADV7611.40 30.54,22.2 v30.33,22.4 | ADV7611.52 35.34,24.37 v34.9,23.93 | ADV7611.57 34.95,26.87 v34.59,26.52 | ADV7611.60 35.79,28.37 v34.59,29.57
  Top 0.305: v60.81,23.77 61.77,23.77 1.8V_REG.4 63.86,17.88 1.8V_D.A | ADV7611.14 28.04,31.08 v27.74,30.79
  Route3 0.305: v60.81,23.77 56.69,19.66 v37.34,19.66
  Bottom 0.254: v34.44,30.94 36.34,30.94 C4.2 37.81,34.85 C3.2 | v23.77,34.44 22.19,34.44 | 22.19,34.44 C9.2 | 22.19,34.44 22.19,32.31 C10.2 | v26.67,24.99 22.29,24.99 C17.2 C18.2 | v30.33,22.4 30.33,18.22 C29.2 27.94,18.12 C30.2 | 37.8,19.66 39.43,19.66 | 39.43,19.66 C21.2 | 39.43,19.66 39.43,17.37 C22.2 | 35.2,24.99 39.03,24.99 C26.2 39.43,24.59 C25.2 | v34.59,29.57 39.23,29.57 | 39.23,29.57 C23.2 | 39.23,29.57 39.23,27.58 C24.2
  Bottom 0.305: 37.8,19.66 v37.34,19.66 34.9,22.1 | 34.9,22.1 v34.9,23.93 34.9,24.69 35.2,24.99 34.59,25.6 v34.59,26.52 34.29,26.52 33.98,26.82 33.98,28.96 v34.59,29.57 | v34.44,30.94 34.59,30.79 v34.59,29.57 | 34.9,22.1 33.83,23.16 31.09,23.16 v30.33,22.4 28.5,22.4 26.67,24.23 v26.67,24.99 27.74,26.06 | v34.59,29.57 34.44,29.72 31.39,29.72 27.74,26.06 | 27.74,26.06 v27.74,30.79
VS  (1 unrouted)
XTALN  (1 unrouted)
  Top 0.254: ADV7611.59 41.74,27.87 42.52,28.65 42.52,32.54 U$2.1
XTALP  (1 unrouted)
  Top 0.254: ADV7611.58 41.82,27.37 42.52,26.67 42.52,23.14 U$2.2